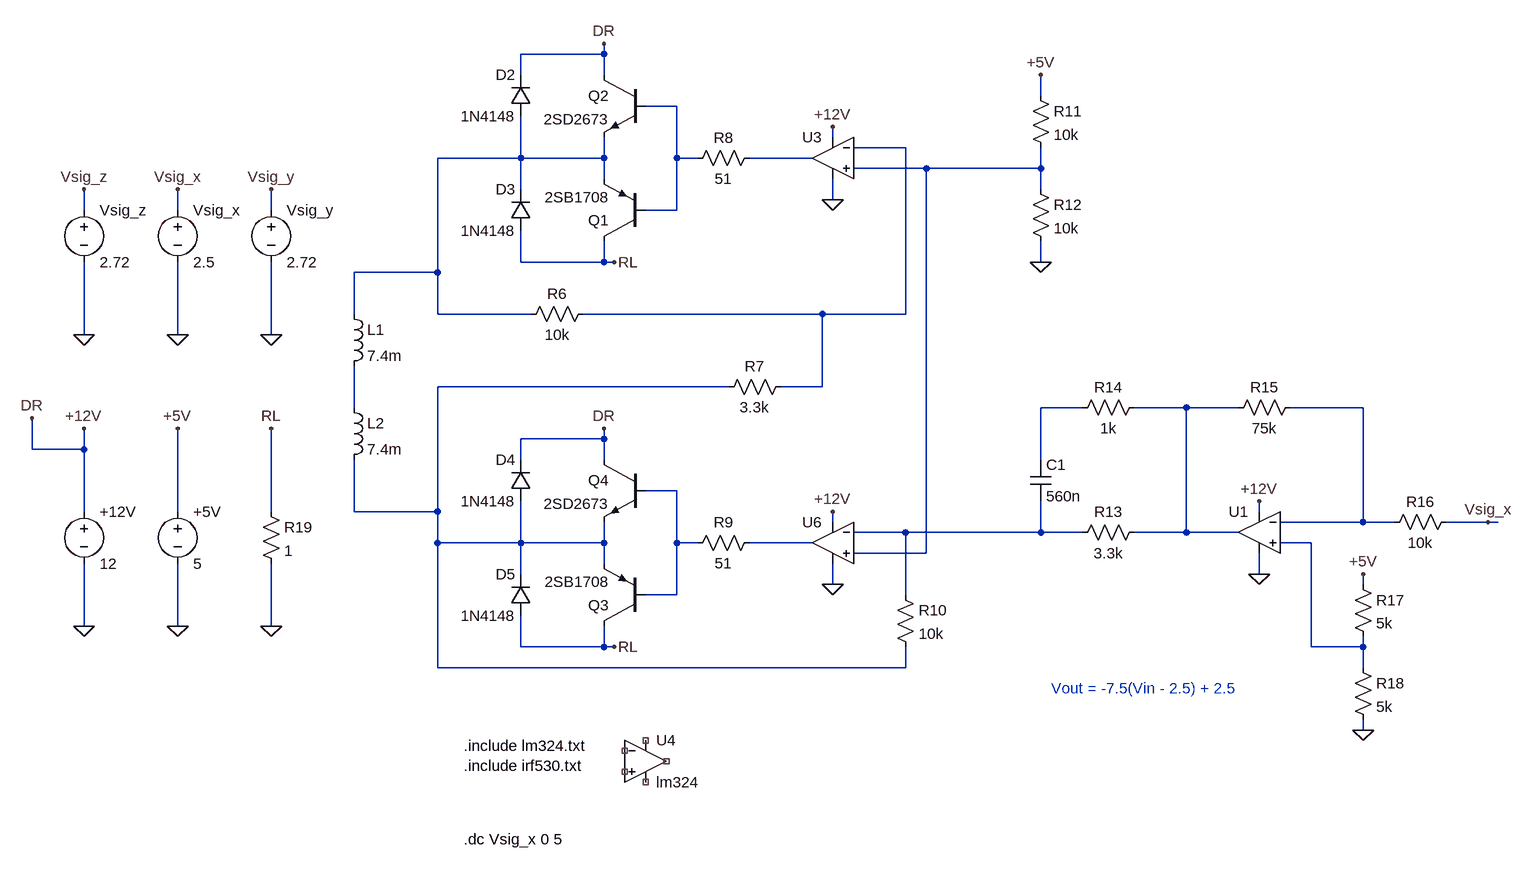
[diagram p0: schematic MagLev_03.asc]
MagLev_03.asc, the LTspice schematic file:
Version 4
SHEET 1 1432 960
WIRE -208 -1264 -208 -1280
WIRE -208 -1264 -336 -1264
WIRE -336 -1232 -336 -1264
WIRE -208 -1232 -208 -1264
WIRE 464 -1200 464 -1232
WIRE -96 -1184 -144 -1184
WIRE 144 -1136 144 -1152
WIRE 256 -1120 176 -1120
WIRE -336 -1104 -336 -1168
WIRE -336 -1104 -464 -1104
WIRE -208 -1104 -208 -1136
WIRE -208 -1104 -336 -1104
WIRE -96 -1104 -96 -1184
WIRE -64 -1104 -96 -1104
WIRE 112 -1104 16 -1104
WIRE 288 -1088 176 -1088
WIRE 464 -1088 464 -1120
WIRE 464 -1088 288 -1088
WIRE -208 -1072 -208 -1104
WIRE -336 -1056 -336 -1104
WIRE 464 -1056 464 -1088
WIRE 144 -1040 144 -1072
WIRE -1008 -1024 -1008 -1056
WIRE -864 -1024 -864 -1056
WIRE -720 -1024 -720 -1056
WIRE -96 -1024 -96 -1104
WIRE -96 -1024 -144 -1024
WIRE -336 -944 -336 -992
WIRE -208 -944 -208 -976
WIRE -208 -944 -336 -944
WIRE -192 -944 -208 -944
WIRE 464 -944 464 -976
WIRE -464 -928 -464 -1104
WIRE -464 -928 -592 -928
WIRE -592 -864 -592 -928
WIRE -464 -864 -464 -928
WIRE -320 -864 -464 -864
WIRE 128 -864 -240 -864
WIRE 256 -864 256 -1120
WIRE 256 -864 128 -864
WIRE -1008 -832 -1008 -944
WIRE -864 -832 -864 -944
WIRE -720 -832 -720 -944
WIRE -16 -752 -464 -752
WIRE 128 -752 128 -864
WIRE 128 -752 64 -752
WIRE -592 -720 -592 -784
WIRE 528 -720 464 -720
WIRE 688 -720 608 -720
WIRE 768 -720 688 -720
WIRE 960 -720 848 -720
WIRE -208 -672 -208 -688
WIRE -208 -672 -336 -672
WIRE -1088 -656 -1088 -704
WIRE -1008 -656 -1008 -688
WIRE -1008 -656 -1088 -656
WIRE -336 -640 -336 -672
WIRE -208 -640 -208 -672
WIRE 464 -640 464 -720
WIRE -96 -592 -144 -592
WIRE -1008 -560 -1008 -656
WIRE -864 -560 -864 -688
WIRE -720 -560 -720 -688
WIRE -592 -560 -592 -640
WIRE -464 -560 -464 -752
WIRE -464 -560 -592 -560
WIRE 800 -560 800 -576
WIRE 144 -544 144 -560
WIRE 960 -544 960 -720
WIRE 960 -544 832 -544
WIRE 1008 -544 960 -544
WIRE 1152 -544 1088 -544
WIRE 1168 -544 1152 -544
WIRE 256 -528 176 -528
WIRE 464 -528 464 -576
WIRE 464 -528 256 -528
WIRE 528 -528 464 -528
WIRE 688 -528 688 -720
WIRE 688 -528 608 -528
WIRE 768 -528 688 -528
WIRE -464 -512 -464 -560
WIRE -336 -512 -336 -576
WIRE -336 -512 -464 -512
WIRE -208 -512 -208 -544
WIRE -208 -512 -336 -512
WIRE -96 -512 -96 -592
WIRE -64 -512 -96 -512
WIRE 112 -512 16 -512
WIRE 880 -512 832 -512
WIRE 288 -496 288 -1088
WIRE 288 -496 176 -496
WIRE -208 -480 -208 -512
WIRE -336 -464 -336 -512
WIRE 800 -464 800 -496
WIRE 144 -448 144 -480
WIRE 960 -448 960 -464
WIRE -96 -432 -96 -512
WIRE -96 -432 -144 -432
WIRE 256 -432 256 -528
WIRE -1008 -384 -1008 -480
WIRE -864 -384 -864 -480
WIRE -720 -384 -720 -480
WIRE -336 -352 -336 -400
WIRE -208 -352 -208 -384
WIRE -208 -352 -336 -352
WIRE -192 -352 -208 -352
WIRE 880 -352 880 -512
WIRE 960 -352 960 -368
WIRE 960 -352 880 -352
WIRE -464 -320 -464 -512
WIRE 256 -320 256 -352
WIRE 256 -320 -464 -320
WIRE 960 -320 960 -352
WIRE 960 -224 960 -240
FLAG -864 -384 0
FLAG -1008 -688 +12V
FLAG -1008 -384 0
FLAG -864 -688 +5V
FLAG -1008 -832 0
FLAG -1008 -1056 Vsig_z
FLAG -864 -832 0
FLAG -720 -832 0
FLAG -864 -1056 Vsig_x
FLAG -720 -1056 Vsig_y
FLAG -208 -1280 DR
FLAG -208 -688 DR
FLAG 144 -448 0
FLAG 144 -560 +12V
FLAG 144 -1040 0
FLAG 144 -1152 +12V
FLAG -192 -944 RL
FLAG -192 -352 RL
FLAG 464 -1232 +5V
FLAG 464 -944 0
FLAG 800 -464 0
FLAG 800 -576 +12V
FLAG 1152 -544 Vsig_x
FLAG 960 -464 +5V
FLAG 960 -224 0
FLAG -720 -384 0
FLAG -720 -688 RL
FLAG -1088 -704 DR
SYMBOL voltage -864 -576 R0
WINDOW 123 0 0 Left 0
WINDOW 39 0 0 Left 0
SYMATTR InstName +5V
SYMATTR Value 5
SYMBOL voltage -1008 -576 R0
WINDOW 123 0 0 Left 0
WINDOW 39 0 0 Left 0
SYMATTR InstName +12V
SYMATTR Value 12
SYMBOL voltage -1008 -1040 R0
WINDOW 123 0 0 Left 0
WINDOW 39 0 0 Left 0
SYMATTR InstName Vsig_z
SYMATTR Value 2.72
SYMBOL voltage -864 -1040 R0
WINDOW 123 0 0 Left 0
WINDOW 39 0 0 Left 0
SYMATTR InstName Vsig_x
SYMATTR Value 2.5
SYMBOL voltage -720 -1040 R0
WINDOW 123 0 0 Left 0
WINDOW 39 0 0 Left 0
SYMATTR InstName Vsig_y
SYMATTR Value 2.72
SYMBOL pnp -144 -976 R180
SYMATTR InstName Q1
SYMATTR Value 2SB1708
SYMBOL npn -144 -1232 M0
SYMATTR InstName Q2
SYMATTR Value 2SD2673
SYMBOL diode -320 -1168 R180
WINDOW 0 24 64 Left 2
WINDOW 3 24 0 Left 2
SYMATTR InstName D2
SYMATTR Value 1N4148
SYMBOL diode -320 -992 R180
WINDOW 0 24 64 Left 2
WINDOW 3 24 0 Left 2
SYMATTR InstName D3
SYMATTR Value 1N4148
SYMBOL diode -320 -576 R180
WINDOW 0 24 64 Left 2
WINDOW 3 24 0 Left 2
SYMATTR InstName D4
SYMATTR Value 1N4148
SYMBOL diode -320 -400 R180
WINDOW 0 24 64 Left 2
WINDOW 3 24 0 Left 2
SYMATTR InstName D5
SYMATTR Value 1N4148
SYMBOL res -224 -880 R90
WINDOW 0 0 56 VBottom 2
WINDOW 3 32 56 VTop 2
SYMATTR InstName R6
SYMATTR Value 10k
SYMBOL res 80 -768 R90
WINDOW 0 0 56 VBottom 2
WINDOW 3 32 56 VTop 2
SYMATTR InstName R7
SYMATTR Value 3.3k
SYMBOL ind -608 -880 R0
SYMATTR InstName L1
SYMATTR Value 7.4m
SYMATTR SpiceLine Rser=6
SYMBOL res 32 -1120 R90
WINDOW 0 0 56 VBottom 2
WINDOW 3 32 56 VTop 2
SYMATTR InstName R8
SYMATTR Value 51
SYMBOL res 32 -528 R90
WINDOW 0 0 56 VBottom 2
WINDOW 3 32 56 VTop 2
SYMATTR InstName R9
SYMATTR Value 51
SYMBOL res 240 -448 R0
SYMATTR InstName R10
SYMATTR Value 10k
SYMBOL res 448 -1216 R0
SYMATTR InstName R11
SYMATTR Value 10k
SYMBOL res 448 -1072 R0
SYMATTR InstName R12
SYMATTR Value 10k
SYMBOL cap 448 -640 R0
SYMATTR InstName C1
SYMATTR Value 560n
SYMBOL res 624 -544 R90
WINDOW 0 0 56 VBottom 2
WINDOW 3 32 56 VTop 2
SYMATTR InstName R13
SYMATTR Value 3.3k
SYMBOL res 624 -736 R90
WINDOW 0 0 56 VBottom 2
WINDOW 3 32 56 VTop 2
SYMATTR InstName R14
SYMATTR Value 1k
SYMBOL res 864 -736 R90
WINDOW 0 0 56 VBottom 2
WINDOW 3 32 56 VTop 2
SYMATTR InstName R15
SYMATTR Value 75k
SYMBOL res 1104 -560 R90
WINDOW 0 0 56 VBottom 2
WINDOW 3 32 56 VTop 2
SYMATTR InstName R16
SYMATTR Value 10k
SYMBOL res 944 -464 R0
SYMATTR InstName R17
SYMATTR Value 5k
SYMBOL res 944 -336 R0
SYMATTR InstName R18
SYMATTR Value 5k
SYMBOL res -736 -576 R0
SYMATTR InstName R19
SYMATTR Value 1
SYMBOL pnp -144 -384 R180
SYMATTR InstName Q3
SYMATTR Value 2SB1708
SYMBOL npn -144 -640 M0
SYMATTR InstName Q4
SYMATTR Value 2SD2673
SYMBOL OpAmps\\UniversalOpAmp2 144 -512 M0
SYMATTR InstName U6
SYMBOL OpAmps\\UniversalOpAmp2 144 -1104 M0
SYMATTR InstName U3
SYMBOL OpAmps\\opamp2 -144 -240 R0
SYMATTR InstName U4
SYMATTR Value lm324
SYMBOL OpAmps\\UniversalOpAmp2 800 -528 M0
SYMATTR InstName U1
SYMBOL ind -608 -736 R0
SYMATTR InstName L2
SYMATTR Value 7.4m
SYMATTR SpiceLine Rser=6
TEXT -424 -200 Left 2 !.include lm324.txt\n.include irf530.txt
TEXT -424 -56 Left 2 !.dc Vsig_x 0 5
TEXT 480 -288 Left 2 ;Vout = -7.5(Vin - 2.5) + 2.5

The netlist it stands for:
* MagLev_03.asc
V§+5V +5V 0 5
V§+12V DR 0 12
Vsig_z Vsig_z 0 2.72
Vsig_x Vsig_x 0 2.5
Vsig_y Vsig_y 0 2.72
Q1 RL N001 N003 0 2SB1708
Q2 DR N001 N003 0 2SD2673
D2 N003 DR 1N4148
D3 RL N003 1N4148
D4 N006 DR 1N4148
D5 RL N006 1N4148
R6 N002 N003 10k
R7 N002 N006 3.3k
L1 N003 N007 7.4m Rser=6
R8 N004 N001 51
R9 N013 N011 51
R10 N012 N006 10k
R11 +5V N005 10k
R12 N005 0 10k
C1 N008 N012 560n
R13 N009 N012 3.3k
R14 N009 N008 1k
R15 N010 N009 75k
R16 Vsig_x N010 10k
R17 +5V N014 5k
R18 N014 0 5k
R19 RL 0 1
Q3 RL N011 N006 0 2SB1708
Q4 DR N011 N006 0 2SD2673
XU6 N005 N012 DR 0 N013 level2 Avol=1Meg GBW=10Meg Slew=10Meg Ilimit=25m Rail=0 Vos=0 En=0 Enk=0 In=0 Ink=0 Rin=500Meg  ; pins In+ In- V+ V- OUT
XU3 N005 N002 DR 0 N004 level2 Avol=1Meg GBW=10Meg Slew=10Meg Ilimit=25m Rail=0 Vos=0 En=0 Enk=0 In=0 Ink=0 Rin=500Meg  ; pins In+ In- V+ V- OUT
XU4 NC_01 NC_02 NC_03 NC_04 NC_05 lm324  ; pins In+ In- V+ V- OUT
XU1 N014 N010 DR 0 N009 level2 Avol=1Meg GBW=10Meg Slew=10Meg Ilimit=25m Rail=0 Vos=0 En=0 Enk=0 In=0 Ink=0 Rin=500Meg  ; pins In+ In- V+ V- OUT
L2 N007 N006 7.4m Rser=6
.model D D
.lib standard.dio
.model NPN NPN
.model PNP PNP
.lib standard.bjt
.include lm324.txt
.include irf530.txt
.dc Vsig_x 0 5
* Vout = -7.5(Vin - 2.5) + 2.5
.lib UniversalOpAmp2.lib
.backanno
.end